# EAGLE design 2MB-Gary-Sel-v3 (EAGLE 6.6.0)
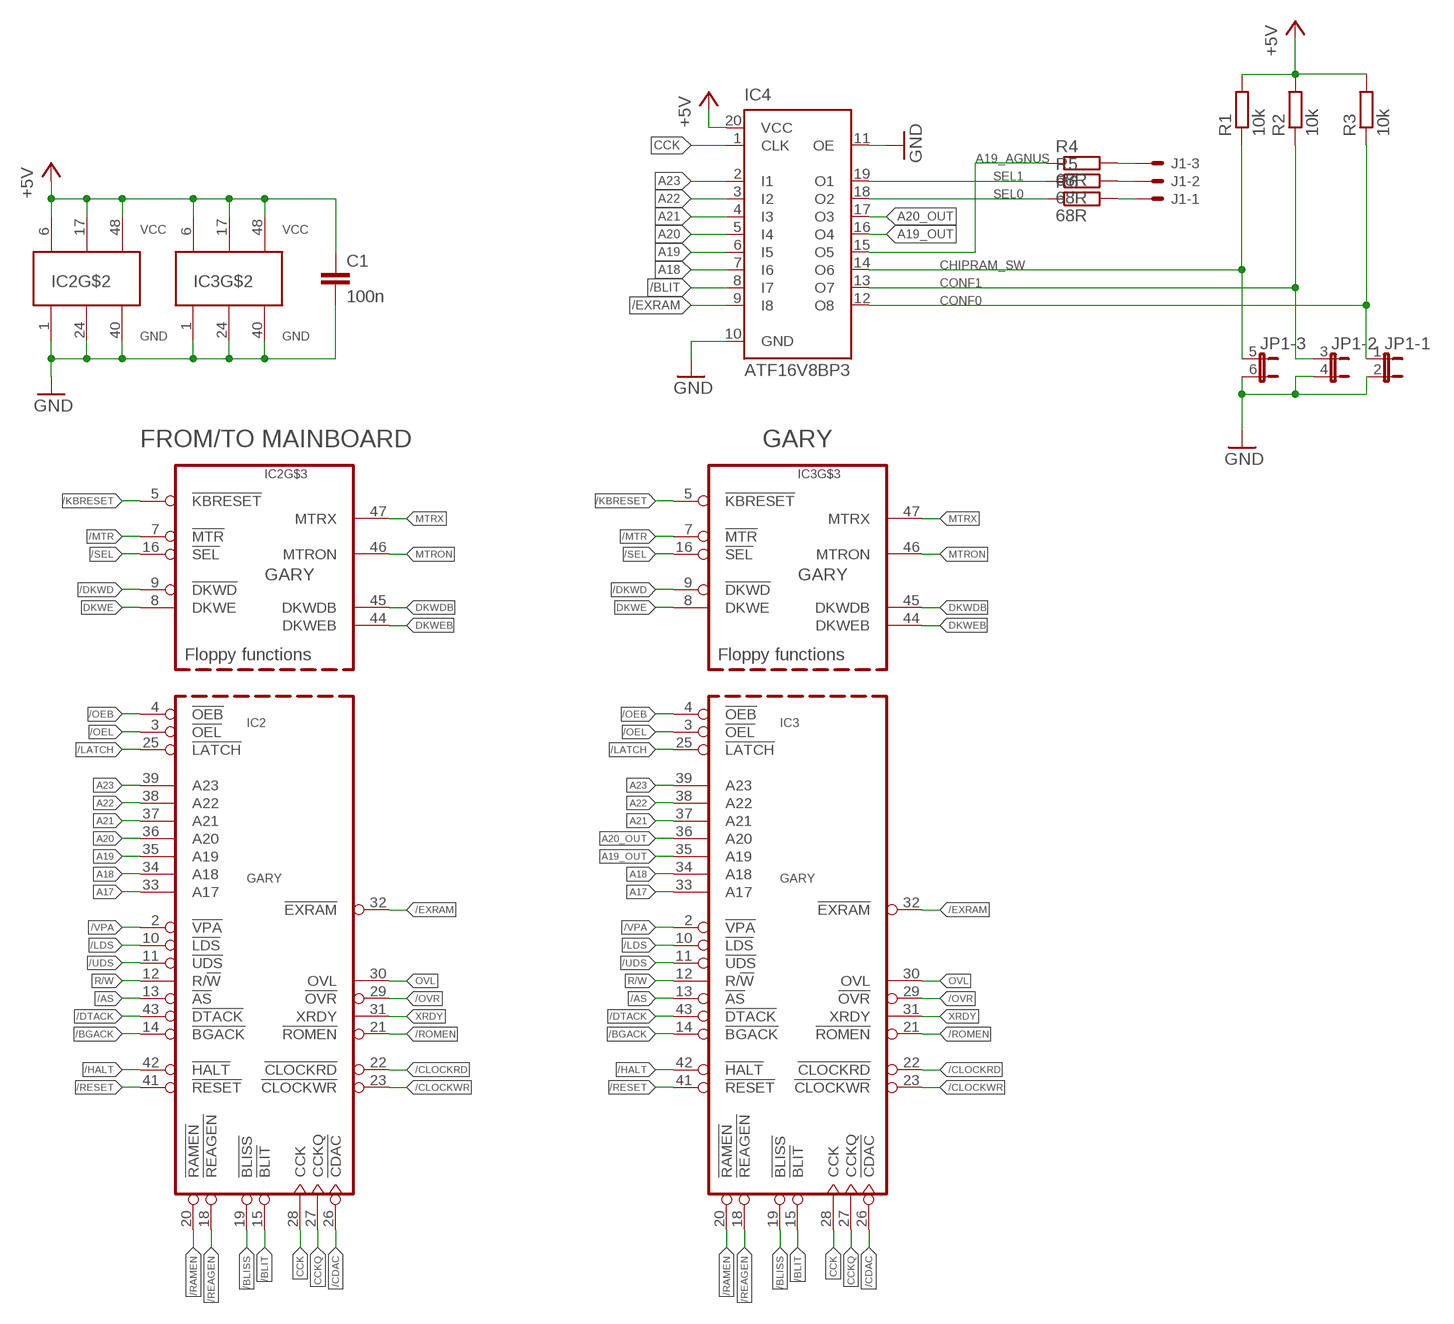
[diagram p0: schematic, sheet 1]

## Parts
C1  100n  C-EUC0805  [C0805]
IC2  GARY_SOCKET  GARYDIP48-6NOPLACE  [DIP48-6NOPLACE]
IC3  GARY  GARY_DIP  [DIP48-6]
IC4  ATF16V8BP3  [DIL20]
J1  22-05-7038-03  [7395-03]
JP1  JP3QE  [JP3Q]
R1  10k  R-EU_R0805  [R0805]
R2  10k  R-EU_R0805  [R0805]
R3  10k  R-EU_R0805  [R0805]
R4  68R  R-EU_R0805  [R0805]
R5  68R  R-EU_R0805  [R0805]
R6  68R  R-EU_R0805  [R0805]

## Nets
+5V [power]: C1.1 IC2.6(VCC) IC2.17(VCC) IC2.48(VCC) IC3.6(VCC) IC3.17(VCC) IC3.48(VCC) IC4.20(VCC) R1.2 R2.2 R3.2
/AS: IC2.13(!AS) IC3.13(!AS)
/BGACK: IC2.14(!BGACK) IC3.14(!BGACK)
/BLISS: IC2.19(!BLISS) IC3.19(!BLISS)
/BLIT: IC2.15(!BLIT) IC3.15(!BLIT) IC4.8(I7)
/CDAC: IC2.26(!CDAC) IC3.26(!CDAC)
/CLOCKRD: IC2.22(!CLOCKRD) IC3.22(!CLOCKRD)
/CLOCKWR: IC2.23(!CLOCKWR) IC3.23(!CLOCKWR)
/DKWD: IC2.9(!DKWD) IC3.9(!DKWD)
/DTACK: IC2.43(!DTACK) IC3.43(!DTACK)
/EXRAM: IC2.32(!EXRAM) IC3.32(!EXRAM) IC4.9(I8)
/HALT: IC2.42(!HALT) IC3.42(!HALT)
/KBRESET: IC2.5(!KBRESET) IC3.5(!KBRESET)
/LATCH: IC2.25(!LATCH) IC3.25(!LATCH)
/LDS: IC2.10(!LDS) IC3.10(!LDS)
/MTR: IC2.7(!MTR) IC3.7(!MTR)
/OEB: IC2.4(!OEB) IC3.4(!OEB)
/OEL: IC2.3(!OEL) IC3.3(!OEL)
/OVR: IC2.29(!OVR) IC3.29(!OVR)
/RAMEN: IC2.20(!RAMEN) IC3.20(!RAMEN)
/REAGEN: IC2.18(!REAGEN) IC3.18(!REAGEN)
/RESET: IC2.41(!RESET) IC3.41(!RESET)
/ROMEN: IC2.21(!ROMEN) IC3.21(!ROMEN)
/SEL: IC2.16(!SEL) IC3.16(!SEL)
/UDS: IC2.11(!UDS) IC3.11(!UDS)
/VPA: IC2.2(!VPA) IC3.2(!VPA)
A17: IC2.33(A17) IC3.33(A17)
A18: IC2.34(A18) IC3.34(A18) IC4.7(I6)
A19: IC2.35(A19) IC4.6(I5)
A19_AGNUS: IC4.15(O5) R4.1
A19_OUT: IC3.35(A19) IC4.16(O4)
A20: IC2.36(A20) IC4.5(I4)
A20_OUT: IC3.36(A20) IC4.17(O3)
A21: IC2.37(A21) IC3.37(A21) IC4.4(I3)
A22: IC2.38(A22) IC3.38(A22) IC4.3(I2)
A23: IC2.39(A23) IC3.39(A23) IC4.2(I1)
CCK: IC2.28(CCK) IC3.28(CCK) IC4.1(CLK)
CCKQ: IC2.27(CCKQ) IC3.27(CCKQ)
CHIPRAM_SW: IC4.14(O6) JP1.5 R1.1
CONF0: IC4.12(O8) JP1.1 R3.1
CONF1: IC4.13(O7) JP1.3 R2.1
DKWDB: IC2.45(DKWDB) IC3.45(DKWDB)
DKWE: IC2.8(DKWE) IC3.8(DKWE)
DKWEB: IC2.44(DKWEB) IC3.44(DKWEB)
GND [power]: C1.2 IC2.1(GND) IC2.24(GND) IC2.40(GND) IC3.1(GND) IC3.24(GND) IC3.40(GND) IC4.10(GND) IC4.11(OE) JP1.2 JP1.4 JP1.6
MTRON: IC2.46(MTRON) IC3.46(MTRON)
MTRX: IC2.47(MTRX) IC3.47(MTRX)
N$1: J1.2 R5.2
N$2: J1.1 R6.2
N$3: J1.3 R4.2
OVL: IC2.30(OVL) IC3.30(OVL)
R/W: IC2.12(R/!W!) IC3.12(R/!W!)
SEL0: IC4.18(O2) R6.1
SEL1: IC4.19(O1) R5.1
XRDY: IC2.31(XRDY) IC3.31(XRDY)

## Notes on the sheet
- FROM/TO MAINBOARD | GARY

## Library data of the parts
C1 = rcl:C-EU: CAPACITOR, European symbol
IC2 IC3 = Amiga:GARY
IC4 = Amiga:ATF16V8B: High perfomance CMOS (electrically erasable) programmable logic device (PLD) ABLE-Atmel-ABEL - P18V8R, P16V8C, P16V8AS, P17V8 COPL Atmel-WinCUPL - G16V8MS, G16V8MA, G16V8AS, G16V8 LOG/IC - GAL16V8_R, GAL16V8_G7, GAL16V8_C), GAL16V8 Tango-PLD - G16V8R, G16V8C, G16V8AS, G16V8 Source: http://www.atmel.com/dyn/resources/prod_documents/DOC0364.PDF; MPN: ATF16V8CZ-15PU; OC_FARNELL: 1551768; OC_NEWARK: 94M6254
J1 = con-molex-own:22-?-03: CONNECTOR wire to board 2.54 mm (.1 inch) pitch header; OC_FARNELL: unknown; OC_NEWARK: unknown
JP1 = jumper:JP3QE: JUMPER
R1-R6 = rcl:R-EU_: RESISTOR, European symbol

## Net classes
0 default: width 0.203 mm
1 power: width 0.61 mm

## Board
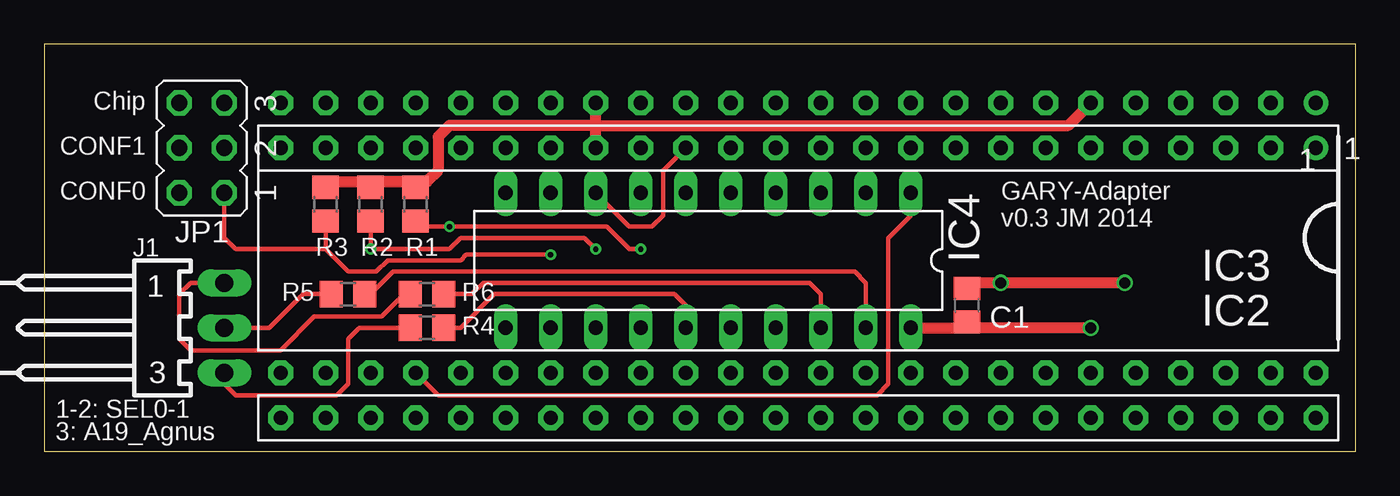
[diagram p1: board, top side]
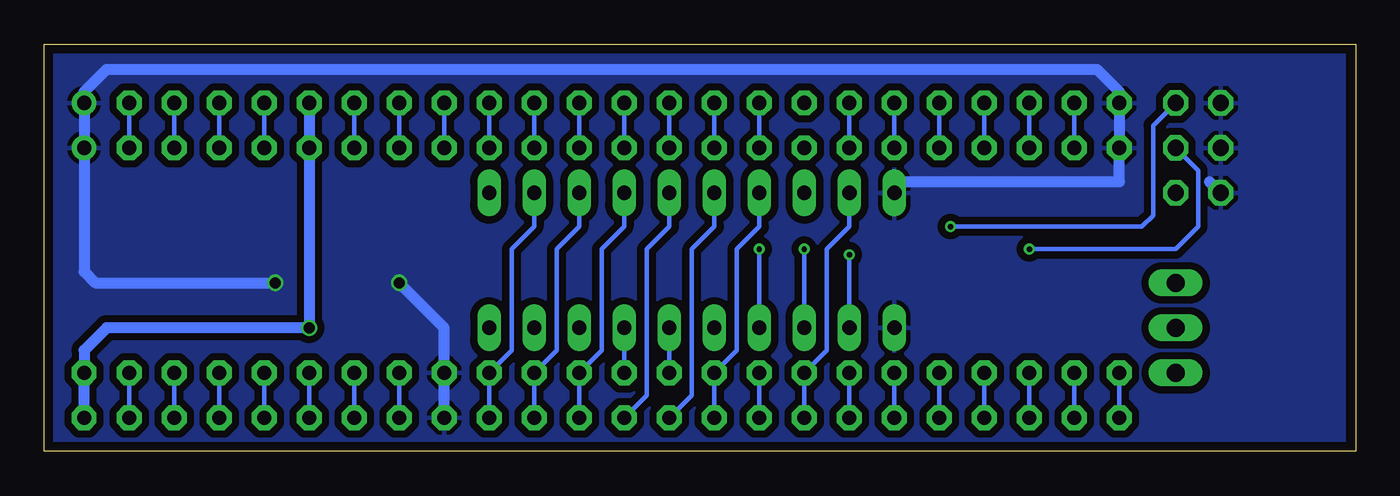
[diagram p2: board, bottom side, seen from below]

Size 74 x 23 mm. Coordinates in mm from the lower left corner, seen from the top.
Outline: 0,0 74,0 74,23 0,23 0,0
Copper layers (1*16): Top 0.035mm / dielectric 1.5mm / Bottom 0.035mm
Design rules "EagleRules": minimum track width 7mil, minimum drill 12mil, track to track 7mil, track to pad 7mil, pad to pad 7mil, via to via 7mil, smd to smd 0mil, copper to edge 20mil, drill to drill 10mil, minimum pad ring 10mil, minimum via ring 6mil, stop-mask expansion 2mil, vias tented up to drill 25mil, thermal gap 10mil

### Footprints (pad centres in the part's own frame; a part is rotated, then mirrored left to right if it is on the bottom)
C0805 = smd 1.3 x 1.5: 1 -0.95,0; 2 0.95,0
DIP48-6NOPLACE = drill 0.8 pad 1.4: 1 -27.94,-7.62 | drill 0.8 pad 1.4 octagon: 2 -25.4,-7.62; 3 -22.86,-7.62; 4 -20.32,-7.62; 5 -17.78,-7.62; 6 -15.24,-7.62; 7 -12.7,-7.62; 8 -10.16,-7.62; 9 -7.62,-7.62; 10 -5.08,-7.62; 11 -2.54,-7.62; 12 0,-7.62; 13 2.54,-7.62; 14 5.08,-7.62; 15 7.62,-7.62; 16 10.16,-7.62; 17 12.7,-7.62; 18 15.24,-7.62; 19 17.78,-7.62; 20 20.32,-7.62; 21 22.86,-7.62; 22 25.4,-7.62; 23 27.94,-7.62; 24 30.48,-7.62; 25 30.48,7.62; 26 27.94,7.62; 27 25.4,7.62; 28 22.86,7.62; 29 20.32,7.62; 30 17.78,7.62; 31 15.24,7.62; 32 12.7,7.62; 33 10.16,7.62; 34 7.62,7.62; 35 5.08,7.62; 36 2.54,7.62; 37 0,7.62; 38 -2.54,7.62; 39 -5.08,7.62; 40 -7.62,7.62; 41 -10.16,7.62; 42 -12.7,7.62; 43 -15.24,7.62; 44 -17.78,7.62; 45 -20.32,7.62; 46 -22.86,7.62; 47 -25.4,7.62; 48 -27.94,7.62
DIP48-6 = drill 0.8 pad 1.4: 1 -27.94,-7.62 | drill 0.8 pad 1.4 octagon: 2 -25.4,-7.62; 3 -22.86,-7.62; 4 -20.32,-7.62; 5 -17.78,-7.62; 6 -15.24,-7.62; 7 -12.7,-7.62; 8 -10.16,-7.62; 9 -7.62,-7.62; 10 -5.08,-7.62; 11 -2.54,-7.62; 12 0,-7.62; 13 2.54,-7.62; 14 5.08,-7.62; 15 7.62,-7.62; 16 10.16,-7.62; 17 12.7,-7.62; 18 15.24,-7.62; 19 17.78,-7.62; 20 20.32,-7.62; 21 22.86,-7.62; 22 25.4,-7.62; 23 27.94,-7.62; 24 30.48,-7.62; 25 30.48,7.62; 26 27.94,7.62; 27 25.4,7.62; 28 22.86,7.62; 29 20.32,7.62; 30 17.78,7.62; 31 15.24,7.62; 32 12.7,7.62; 33 10.16,7.62; 34 7.62,7.62; 35 5.08,7.62; 36 2.54,7.62; 37 0,7.62; 38 -2.54,7.62; 39 -5.08,7.62; 40 -7.62,7.62; 41 -10.16,7.62; 42 -12.7,7.62; 43 -15.24,7.62; 44 -17.78,7.62; 45 -20.32,7.62; 46 -22.86,7.62; 47 -25.4,7.62; 48 -27.94,7.62
DIL20 = drill 0.813 long: 1 -11.43,-3.81; 2 -8.89,-3.81; 3 -6.35,-3.81; 4 -3.81,-3.81; 5 -1.27,-3.81; 6 1.27,-3.81; 7 3.81,-3.81; 8 6.35,-3.81; 9 8.89,-3.81; 10 11.43,-3.81; 11 11.43,3.81; 12 8.89,3.81; 13 6.35,3.81; 14 3.81,3.81; 15 1.27,3.81; 16 -1.27,3.81; 17 -3.81,3.81; 18 -6.35,3.81; 19 -8.89,3.81; 20 -11.43,3.81
7395-03 = drill 1.016 long: 1 -2.54,0; 2 0,0; 3 2.54,0
JP3Q = drill 0.914 octagon: 1 -2.54,-1.27; 2 -2.54,1.27; 3 0,-1.27; 4 0,1.27; 5 2.54,-1.27; 6 2.54,1.27
R0805 = smd 1.3 x 1.5: 1 -0.95,0; 2 0.95,0

### Placement (x,y rotation side)
C1  52.07,8.26 90 top
IC2  43.81,9.53 180 top
IC3  43.81,12.06 180 top
IC4  37.47,10.79 180 top
J1  10.16,6.99 270 top
JP1  8.89,17.14 90 top
R1  20.95,13.97 90 top
R2  18.41,13.97 90 top
R3  15.88,13.97 90 top
R4  21.59,6.99 180 top
R5  17.14,8.89 180 top
R6  21.59,8.89 180 top

### Tracks (layer width: path | path; a pad name or v marks a point on that pad's centre or on a via)
+5V  (via drill 0.61)
  Top 0.61: R3.2 15.88,15.24 18.09,15.24 | 18.09,15.24 21.59,15.24 22.23,15.88 22.23,17.78 22.86,18.41 31.11,18.41 | 18.09,15.24 R2.2 18.41,15.24 20.64,15.24 R1.2 20.95,15.24 | v59.05,6.99 51.76,6.99 | 51.76,6.99 51.75,6.99 | 51.76,6.99 C1.1 | C1.1 51.44,6.99 | 51.44,6.99 51.75,6.99 | 31.11,18.41 IC3.17 | 31.11,18.41 57.78,18.41 IC3.6 | IC4.20 51.44,6.99 | 51.75,6.99 C1.1 | IC2.17 31.11,18.41
  Bottom 0.61: IC2.48 IC3.48 71.75,5.71 70.48,6.99 v59.05,6.99 IC2.6 IC3.6
/AS
  Bottom 0.254: IC3.13 IC2.13
/BGACK
  Bottom 0.254: IC3.14 IC2.14
/BLISS
  Bottom 0.254: IC3.19 IC2.19
/BLIT
  Top 0.254: IC4.8 33.02,12.7 34.29,12.7 34.92,13.34 34.92,15.88 IC2.15
  Bottom 0.254: IC3.15 IC2.15
/CDAC
  Bottom 0.254: IC3.26 IC2.26
/CLOCKRD
  Bottom 0.254: IC3.22 IC2.22
/CLOCKWR
  Bottom 0.254: IC3.23 IC2.23
/DKWD
  Bottom 0.254: IC3.9 IC2.9
/DTACK
  Bottom 0.254: IC2.43 IC3.43
/EXRAM
  Bottom 0.254: IC2.32 IC3.32 29.84,5.71 29.84,11.43 28.57,12.7 IC4.9
/HALT
  Bottom 0.254: IC2.42 IC3.42
/KBRESET
  Bottom 0.254: IC3.5 IC2.5
/LATCH
  Bottom 0.254: IC3.25 IC2.25
/LDS
  Bottom 0.254: IC3.10 IC2.10
/MTR
  Bottom 0.254: IC3.7 IC2.7
/OEB
  Bottom 0.254: IC3.4 IC2.4
/OEL
  Bottom 0.254: IC3.3 IC2.3
/OVR
  Bottom 0.254: IC3.29 IC2.29
/RAMEN
  Bottom 0.254: IC3.20 IC2.20
/REAGEN
  Bottom 0.254: IC3.18 IC2.18
/RESET
  Bottom 0.254: IC2.41 IC3.41
/ROMEN
  Bottom 0.254: IC3.21 IC2.21
/SEL
  Bottom 0.254: IC3.16 IC2.16
/UDS
  Bottom 0.254: IC3.11 IC2.11
/VPA
  Bottom 0.254: IC3.2 IC2.2
A17
  Bottom 0.254: IC3.33 IC2.33
A18
  Bottom 0.254: IC2.34 IC3.34 34.92,5.71 34.92,11.43 33.66,12.7 IC4.7
A19
  Bottom 0.254: IC2.35 37.47,3.17 37.47,11.43 36.2,12.7 IC4.6
A19_AGNUS
  Top 0.254: IC4.15 36.2,8.26 35.56,8.89 25.4,8.89 23.5,6.99 R4.1
A19_OUT
  Bottom 0.254: IC3.35 IC4.16
A20
  Bottom 0.254: IC2.36 40.01,3.17 40.01,11.43 38.73,12.7 IC4.5
A20_OUT
  Bottom 0.254: IC3.36 IC4.17
A21
  Bottom 0.254: IC2.37 IC3.37 42.55,5.71 42.55,11.43 41.27,12.7 IC4.4
A22
  Bottom 0.254: IC2.38 IC3.38 45.09,5.71 45.09,11.43 43.81,12.7 IC4.3
A23
  Bottom 0.254: IC2.39 IC3.39 47.62,5.71 47.62,11.43 46.35,12.7 IC4.2
CCK
  Top 0.254: IC4.1 48.9,13.34 47.62,12.06 47.62,3.81 46.99,3.17 22.23,3.17 IC3.28
  Bottom 0.254: IC3.28 IC2.28
CCKQ
  Bottom 0.254: IC3.27 IC2.27
CHIPRAM_SW  (via drill 0.3)
  Top 0.254: R1.1 20.95,12.7 v22.86,12.7 31.75,12.7 33.02,11.43 v33.66,11.43
  Bottom 0.254: JP1.5 11.43,18.41 11.43,13.34 12.06,12.7 v22.86,12.7 | IC4.14 v33.66,11.43
CONF0  (via drill 0.3)
  Top 0.254: v28.57,11.11 23.81,11.11 23.5,10.79 19.37,10.79 18.73,10.16 17.14,10.16 15.88,11.43 | 15.88,11.43 R3.1 | 15.88,11.43 10.79,11.43 10.16,12.06 JP1.1
  Bottom 0.254: IC4.12 v28.57,11.11
CONF1  (via drill 0.3)
  Top 0.254: R2.1 v18.41,11.43 22.86,11.43 23.5,12.06 30.48,12.06 v31.11,11.43
  Bottom 0.254: v18.41,11.43 10.16,11.43 8.89,12.7 8.89,15.88 JP1.3 | IC4.13 v31.11,11.43
DKWDB
  Bottom 0.254: IC2.45 IC3.45
DKWE
  Bottom 0.254: IC3.8 IC2.8
DKWEB
  Bottom 0.254: IC2.44 IC3.44
GND  (via drill 0.61)
  Top 0.61: C1.2 52.39,9.53 v53.98,9.53 v60.96,9.53
  Bottom 0.61: 25.4,15.24 13.34,15.24 IC2.24 IC3.24 13.34,20.32 14.61,21.59 70.48,21.59 71.75,20.32 IC3.1 IC2.1 71.75,10.16 71.12,9.53 v60.96,9.53 | IC2.40 IC3.40 51.44,6.99 v53.98,9.53 | JP1.2 8.26,15.24
  pour Bottom (isolate 0.406): 0.64,0 0.64,22.86 73.66,22.86 73.66,0
MTRON
  Bottom 0.254: IC2.46 IC3.46
MTRX
  Bottom 0.254: IC2.47 IC3.47
N$1
  Top 0.254: R5.2 14.61,8.89 12.7,6.99 J1.2
N$2
  Top 0.254: R6.2 20.32,8.89 19.05,7.62 15.24,7.62 13.34,5.71 8.26,5.71 7.62,6.35 7.62,8.89 8.26,9.53 J1.1
N$3
  Top 0.254: R4.2 17.78,6.99 17.14,6.35 17.14,3.81 16.51,3.17 10.79,3.17 10.16,3.81 J1.3
OVL
  Bottom 0.254: IC3.30 IC2.30
R/W
  Bottom 0.254: IC3.12 IC2.12
SEL0
  Top 0.254: IC4.18 43.81,8.89 43.18,9.53 24.77,9.53 24.13,8.89 R6.1
SEL1
  Top 0.254: IC4.19 46.35,9.53 45.72,10.16 19.68,10.16 18.41,8.89 R5.1
XRDY
  Bottom 0.254: IC3.31 IC2.31

### Text on the board
tPlace: Chip | CONF1 | CONF0 | GARY-Adapter / v0.3 JM 2014 | 1-2: SEL0-1 | 3: A19_Agnus